# EAGLE schematic ME433_HW6_sch (EAGLE 9.6.2)
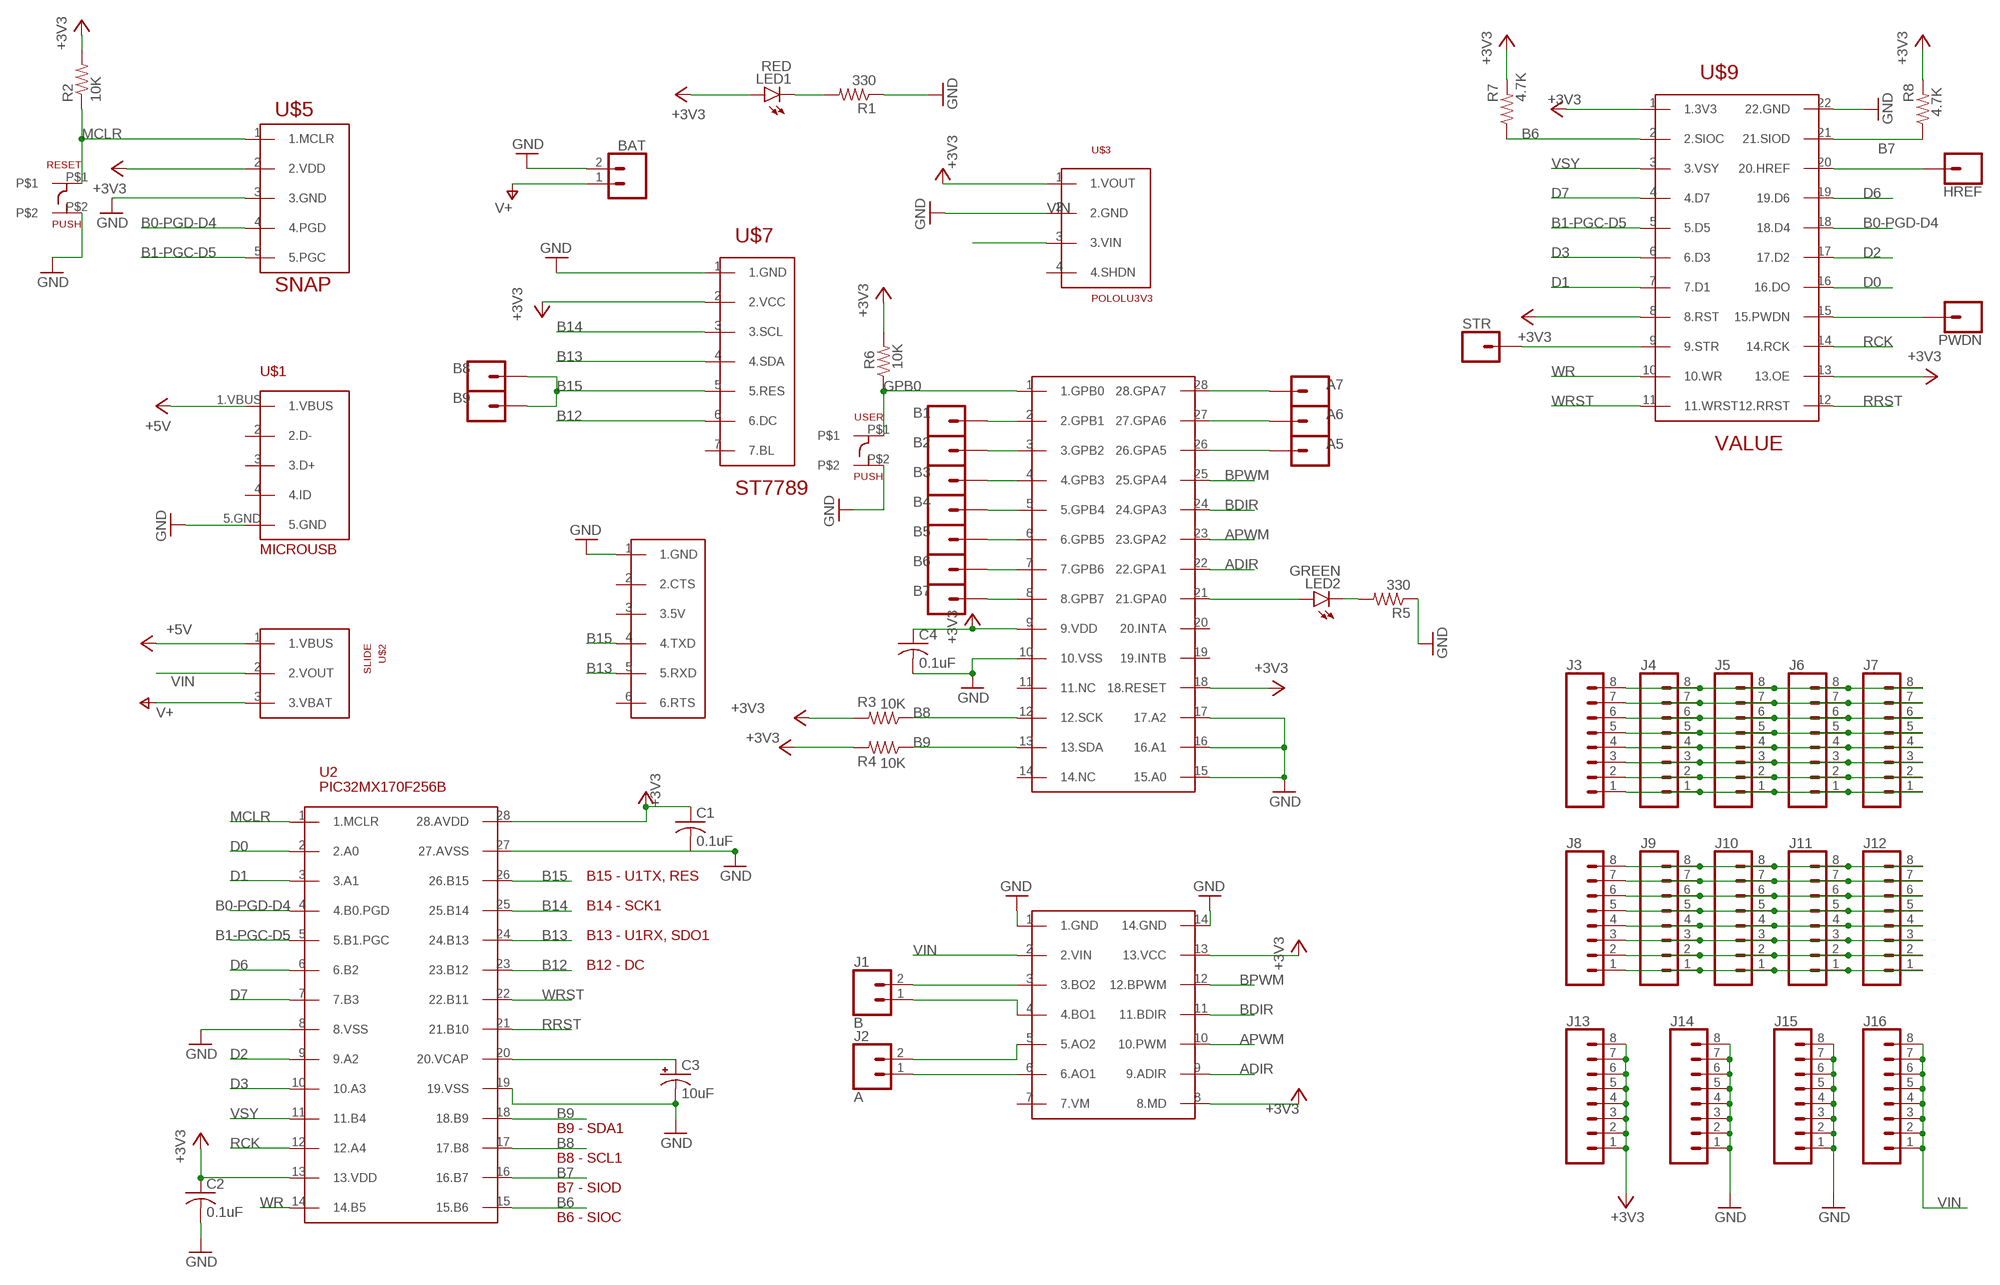
[diagram p0: schematic, sheet 1]

## Parts
A5  CONN_01  [1X01]
A6  CONN_01  [1X01]
A7  CONN_01  [1X01]
B1  CONN_01  [1X01]
B2  CONN_01  [1X01]
B3  CONN_01  [1X01]
B4  CONN_01  [1X01]
B5  CONN_01  [1X01]
B6  CONN_01  [1X01]
B7  CONN_01  [1X01]
B8  CONN_01  [1X01]
B9  CONN_01  [1X01]
BAT  CONN_02  [1X02]
C1  0.1uF  C-US025-030X050  [C025-030X050]
C2  0.1uF  C-US025-030X050  [C025-030X050]
C3  10uF  CPOL-USB45181B  [B45181B]
C4  0.1uF  C-US025-030X050  [C025-030X050]
HREF  CONN_01  [1X01]
J1  B  CONN_02  [1X02]
J2  A  CONN_02  [1X02]
J3  CONN_08"  [1X08]
J4  CONN_08"  [1X08]
J5  CONN_08"  [1X08]
J6  CONN_08"  [1X08]
J7  CONN_08"  [1X08]
J8  CONN_08"  [1X08]
J9  CONN_08"  [1X08]
J10  CONN_08"  [1X08]
J11  CONN_08"  [1X08]
J12  CONN_08"  [1X08]
J13  CONN_08"  [1X08]
J14  CONN_08"  [1X08]
J15  CONN_08"  [1X08]
J16  CONN_08"  [1X08]
LED1  RED  LED3MM  [LED3MM]
LED2  GREEN  LED3MM  [LED3MM]
PWDN  CONN_01  [1X01]
R1  330  R-US_0207/10  [0207/10]
R2  10K  R-US_0207/10  [0207/10]
R3  10K  R-US_0207/10  [0207/10]
R4  10K  R-US_0207/10  [0207/10]
R5  330  R-US_0207/10  [0207/10]
R6  10K  R-US_0207/10  [0207/10]
R7  4.7K  R-US_0207/10  [0207/10]
R8  4.7K  R-US_0207/10  [0207/10]
RESET  PUSH  [PUSH]
STR  CONN_01  [1X01]
U2  PIC32MX170F256B  [DIL28-3]
U$1  MICROUSB  [MICROUSB]
U$2  SLIDE  [SLIDE]
U$3  POLOLU3V3  [POLOLU3V3]
U$4  DRV8835  [DRV8835]
U$5  SNAP  [SNAP]
U$6  CP2104_FRIEND  [CP2104_FRIEND]
U$7  ST7789  [ST7789]
U$8  MCP23017  [DIL28-3]
U$9  OV7670FIFO  [OV7670FIFO]
USER  PUSH  [PUSH]

## Nets
+3V3: C1.1 C2.1 C4.1 J13.1 J13.2 J13.3 J13.4 J13.5 J13.6 J13.7 J13.8 LED1.A R2.2 R3.2 R4.2 R6.2 R7.2 R8.2 U2.13(13.VDD) U2.28(28.AVDD) U$3.1(1.VOUT) U$4.8(8.MD) U$4.13(13.VCC) U$5.2(2.VDD) U$7.2(2.VCC) U$8.9(9.VDD) U$8.18(18.RESET) U$9.1(1.3V3) U$9.8(8.RST) U$9.13(13.OE)
+5V: U$1.1.VBUS U$2.1(1.VBUS)
ADIR: U$4.9(9.ADIR) U$8.22(22.GPA1)
APWM: U$4.10(10.PWM) U$8.23(23.GPA2)
B0-PGD-D4: U2.4(4.B0.PGD) U$5.4(4.PGD) U$9.18(18.D4)
B1-PGC-D5: U2.5(5.B1.PGC) U$5.5(5.PGC) U$9.5(5.D5)
B6: R7.1 U2.15(15.B6) U$9.2(2.SIOC)
B7: R8.1 U2.16(16.B7) U$9.21(21.SIOD)
B8: R3.1 U2.17(17.B8) U$8.12(12.SCK)
B9: R4.1 U2.18(18.B9) U$8.13(13.SDA)
B12: U2.23(23.B12) U$7.6(6.DC)
B13: U2.24(24.B13) U$6.5(5.RXD) U$7.4(4.SDA)
B14: U2.25(25.B14) U$7.3(3.SCL)
B15: B8.1 B9.1 U2.26(26.B15) U$6.4(4.TXD) U$7.5(5.RES)
BDIR: U$4.11(11.BDIR) U$8.24(24.GPA3)
BPWM: U$4.12(12.BPWM) U$8.25(25.GPA4)
D0: U2.2(2.A0) U$9.16(16.DO)
D1: U2.3(3.A1) U$9.7(7.D1)
D2: U2.9(9.A2) U$9.17(17.D2)
D3: U2.10(10.A3) U$9.6(6.D3)
D6: U2.6(6.B2) U$9.19(19.D6)
D7: U2.7(7.B3) U$9.4(4.D7)
GND: BAT.2 C1.2 C2.2 C3.- C4.2 J14.1 J14.2 J14.3 J14.4 J14.5 J14.6 J14.7 J14.8 J15.1 J15.2 J15.3 J15.4 J15.5 J15.6 J15.7 J15.8 R1.1 R5.1 RESET.P$2 U2.8(8.VSS) U2.19(19.VSS) U2.27(27.AVSS) U$1.5.GND U$3.2(2.GND) U$4.1(1.GND) U$4.14(14.GND) U$5.3(3.GND) U$6.1(1.GND) U$7.1(1.GND) U$8.10(10.VSS) U$8.15(15.A0) U$8.16(16.A1) U$8.17(17.A2) U$9.22(22.GND) USER.P$2
GPB0: R6.1 U$8.1(1.GPB0) USER.P$1
MCLR: R2.1 RESET.P$1 U2.1(1.MCLR) U$5.1(1.MCLR)
N$1: LED1.K(C) R1.2
N$2: C3.+ U2.20(20.VCAP)
N$3: LED2.K(C) R5.2
N$4: LED2.A U$8.21(21.GPA0)
N$5: J1.2 U$4.3(3.BO2)
N$6: J1.1 U$4.4(4.BO1)
N$7: J2.2 U$4.5(5.AO2)
N$8: J2.1 U$4.6(6.AO1)
N$9: STR.1 U$9.9(9.STR)
N$10: HREF.1 U$9.20(20.HREF)
N$11: PWDN.1 U$9.15(15.PWDN)
N$12: B1.1 U$8.2(2.GPB1)
N$13: B2.1 U$8.3(3.GPB2)
N$14: B3.1 U$8.4(4.GPB3)
N$15: B4.1 U$8.5(5.GPB4)
N$16: B5.1 U$8.6(6.GPB5)
N$17: B6.1 U$8.7(7.GPB6)
N$18: B7.1 U$8.8(8.GPB7)
N$19: A7.1 U$8.28(28.GPA7)
N$20: A6.1 U$8.27(27.GPA6)
N$21: A5.1 U$8.26(26.GPA5)
N$22: J3.8 J4.8 J5.8 J6.8 J7.8
N$23: J3.7 J4.7 J5.7 J6.7 J7.7
N$24: J3.6 J4.6 J5.6 J6.6 J7.6
N$25: J3.5 J4.5 J5.5 J6.5 J7.5
N$26: J3.4 J4.4 J5.4 J6.4 J7.4
N$27: J3.3 J4.3 J5.3 J6.3 J7.3
N$28: J3.2 J4.2 J5.2 J6.2 J7.2
N$29: J3.1 J4.1 J5.1 J6.1 J7.1
N$30: J8.8 J9.8 J10.8 J11.8 J12.8
N$31: J8.7 J9.7 J10.7 J11.7 J12.7
N$32: J8.6 J9.6 J10.6 J11.6 J12.6
N$33: J8.5 J9.5 J10.5 J11.5 J12.5
N$34: J8.4 J9.4 J10.4 J11.4 J12.4
N$35: J8.3 J9.3 J10.3 J11.3 J12.3
N$36: J8.2 J9.2 J10.2 J11.2 J12.2
N$37: J8.1 J9.1 J10.1 J11.1 J12.1
RCK: U2.12(12.A4) U$9.14(14.RCK)
RRST: U2.21(21.B10) U$9.12(12.RRST)
V+: BAT.1 U$2.3(3.VBAT)
VIN: J16.1 J16.2 J16.3 J16.4 J16.5 J16.6 J16.7 J16.8 U$2.2(2.VOUT) U$3.3(3.VIN) U$4.2(2.VIN)
VSY: U2.11(11.B4) U$9.3(3.VSY)
WR: U2.14(14.B5) U$9.10(10.WR)
WRST: U2.22(22.B11) U$9.11(11.WRST)
Unconnected: U$1.2(2.D-) U$1.3(3.D+) U$1.4(4.ID) U$3.4(4.SHDN) U$4.7(7.VM) U$6.2(2.CTS) U$6.3(3.5V) U$6.6(6.RTS) U$7.7(7.BL) U$8.11(11.NC) U$8.14(14.NC) U$8.19(19.INTB) U$8.20(20.INTA)

## Notes on the sheet
- B15 - U1TX, RES
- B14 - SCK1
- B13 - U1RX, SDO1
- B12 - DC
- B9 - SDA1
- B8 - SCL1
- B7 - SIOD
- B6 - SIOC

## Library data of the parts
A5-A7 B1-B9 HREF PWDN STR = ME433:CONN_01: Single connection point. Often used as Generic Header-pin footprint for 0.1 inch spaced/style header connections On any of the 0.1 inch spaced packages, you can populate with these: Break Away Headers - Straight <https://www.sparkfun.com/products/116> (PRT-00116) Break Away Male Headers - Right Angle <https://www.sparkfun.com/products/553> (PRT-00553) Female Headers <https://www.sparkfun.com/products/115> (PRT-00115) Break Away Headers - Machine Pin <https://www.sparkfun.com/products/117> (PRT-00117) Break Away Female Headers - Swiss Machine Pin <https://www.sparkfun.com/products/743> (PRT-00743) This device is also useful as a general connection point to wire up your design to another part of your project. Our various solder wires solder well into these plated through hole pads. Hook-Up Wire - Assortment (Stranded, 22 AWG) <https://www.sparkfun.com/products/11375> (PRT-11375) Hook-Up Wire - Assortment (Solid Core, 22 AWG) <https://www.sparkfun.com/products/11367> (PRT-11367) View the entire wire category on our website here <https://www.sparkfun.com/categories/141> Special notes: SMTSO-256-ET is a "flush mount" nut for a 4-40 screw. We mostly use this on specialty testbeds; it is a nice way to connect hardware to your PCB at an adjustable hieght. Also note, the SNAP packages are for using a snappable style connector. We sell a baggie of snaps and they are also used on two LilyPad designs: Snap Assortment - 30 pack (male and female) <https://www.sparkfun.com/products/11347> (DEV-11347) LilyPad Arduino SimpleSnap <https://www.sparkfun.com/products/10941> (DEV-10941) LilyPad SimpleSnap Protoboard <https://www.sparkfun.com/products/10940> (DEV-10940)
BAT J1 J2 = ME433:CONN_02: Multi connection point. Often used as Generic Header-pin footprint for 0.1 inch spaced/style header connections On any of the 0.1 inch spaced packages, you can populate with these: Break Away Headers - Straight <https://www.sparkfun.com/products/116> (PRT-00116) Break Away Male Headers - Right Angle <https://www.sparkfun.com/products/553> (PRT-00553) Female Headers <https://www.sparkfun.com/products/115> (PRT-00115) Break Away Headers - Machine Pin <https://www.sparkfun.com/products/117> (PRT-00117) Break Away Female Headers - Swiss Machine Pin <https://www.sparkfun.com/products/743> (PRT-00743) For SCREWTERMINALS and SPRING TERMINALS visit here: Screw Terimnals on SparkFun.com <https://www.sparkfun.com/search/results?term=Screw+Terminals> (5mm/3.5mm/2.54mm spacing) This device is also useful as a general connection point to wire up your design to another part of your project. Our various solder wires solder well into these plated through hole pads. Hook-Up Wire - Assortment (Stranded, 22 AWG) <https://www.sparkfun.com/products/11375> (PRT-11375) Hook-Up Wire - Assortment (Solid Core, 22 AWG) <https://www.sparkfun.com/products/11367> (PRT-11367) View the entire wire category on our website here <https://www.sparkfun.com/categories/141> Special notes: Molex polarized connector foot print use with: PRT-08233 with associated crimp pins and housings. 2.54_SCREWTERM for use with PRT-10571. 3.5mm Screw Terminal footprints for PRT-08084 5mm Screw Terminal footprints for use with PRT-08432
C1 C2 C4 = ME433:C-US: CAPACITOR, American symbol; SPICEPREFIX: C
C3 = ME433:CPOL-US: POLARIZED CAPACITOR, American symbol; SPICEPREFIX: C
J3-J16 = ME433:CONN_08: Multi connection point. Often used as Generic Header-pin footprint for 0.1 inch spaced/style header connections On any of the 0.1 inch spaced packages, you can populate with these: Break Away Headers - Straight <https://www.sparkfun.com/products/116> (PRT-00116) Break Away Male Headers - Right Angle <https://www.sparkfun.com/products/553> (PRT-00553) Female Headers <https://www.sparkfun.com/products/115> (PRT-00115) Break Away Headers - Machine Pin <https://www.sparkfun.com/products/117> (PRT-00117) Break Away Female Headers - Swiss Machine Pin <https://www.sparkfun.com/products/743> (PRT-00743) Arduino Stackable Header - 8 Pin <https://www.sparkfun.com/products/9279> (PRT-09279) For SCREWTERMINALS and SPRING TERMINALS visit here: Screw Terimnals on SparkFun.com <https://www.sparkfun.com/search/results?term=Screw+Terminals> (5mm/3.5mm/2.54mm spacing) This device is also useful as a general connection point to wire up your design to another part of your project. Our various solder wires solder well into these plated through hole pads. Hook-Up Wire - Assortment (Stranded, 22 AWG) <https://www.sparkfun.com/products/11375> (PRT-11375) Hook-Up Wire - Assortment (Solid Core, 22 AWG) <https://www.sparkfun.com/products/11367> (PRT-11367) View the entire wire category on our website here <https://www.sparkfun.com/categories/141> Special notes: Molex polarized connector foot print use with SKU : PRT-08231 with associated crimp pins and housings. 1MM SMD Version SKU: PRT-10208 NOTES ON THE VARIANTS LOCK and LOCK_LONGPADS... This footprint was designed to help hold the alignment of a through-hole component (i.e. 6-pin header) while soldering it into place. You may notice that each hole has been shifted either up or down by 0.005 of an inch from it's more standard position (which is a perfectly straight line). This slight alteration caused the pins (the squares in the middle) to touch the edges of the holes. Because they are alternating, it causes a "brace" to hold the component in place. 0.005 has proven to be the perfect amount of "off-center" position when using our standard breakaway headers. Although looks a little odd when you look at the bare footprint, once you have a header in there, the alteration is very hard to notice. Also,if you push a header all the way into place, it is covered up entirely on the bottom side.; PROD_ID: CONN-08438
LED1 LED2 = ME433:LED: LED OSRAM: - CHIPLED LG R971, LG N971, LY N971, LG Q971, LY Q971, LO R971, LY R971 LH N974, LH R974 LS Q976, LO Q976, LY Q976 LO Q996 - Hyper CHIPLED LW Q18S LB Q993, LB Q99A, LB R99A - SideLED LS A670, LO A670, LY A670, LG A670, LP A670 LB A673, LV A673, LT A673, LW A673 LH A674 LY A675 LS A676, LA A676, LO A676, LY A676, LW A676 LS A679, LY A679, LG A679 - Hyper Micro SIDELED® LS Y876, LA Y876, LO Y876, LY Y876 LT Y87S - SmartLED LW L88C, LW L88S LB L89C, LB L89S, LG L890 LS L89K, LO L89K, LY L89K LS L896, LA L896, LO L896, LY L896 - TOPLED LS T670, LO T670, LY T670, LG T670, LP T670 LSG T670, LSP T670, LSY T670, LOP T670, LYG T670 LG T671, LOG T671, LSG T671 LB T673, LV T673, LT T673, LW T673 LH T674 LS T676, LA T676, LO T676, LY T676, LB T676, LH T676, LSB T676, LW T676 LB T67C, LV T67C, LT T67C, LS T67K, LO T67K, LY T67K, LW E67C LS E67B, LA E67B, LO E67B, LY E67B, LB E67C, LV E67C, LT E67C LW T67C LS T679, LY T679, LG T679 LS T770, LO T770, LY T770, LG T770, LP T770 LB T773, LV T773, LT T773, LW T773 LH T774 LS E675, LA E675, LY E675, LS T675 LS T776, LA T776, LO T776, LY T776, LB T776 LHGB T686 LT T68C, LB T68C - Hyper Mini TOPLED® LB M676 - Mini TOPLED Santana® LG M470 LS M47K, LO M47K, LY M47K Source: http://www.osram.convergy.de LUXEON: - LUMILED® LXK2-PW12-R00, LXK2-PW12-S00, LXK2-PW14-U00, LXK2-PW14-V00 LXK2-PM12-R00, LXK2-PM12-S00, LXK2-PM14-U00 LXK2-PE12-Q00, LXK2-PE12-R00, LXK2-PE12-S00, LXK2-PE14-T00, LXK2-PE14-U00 LXK2-PB12-K00, LXK2-PB12-L00, LXK2-PB12-M00, LXK2-PB14-N00, LXK2-PB14-P00, LXK2-PB14-Q00 LXK2-PR12-L00, LXK2-PR12-M00, LXK2-PR14-Q00, LXK2-PR14-R00 LXK2-PD12-Q00, LXK2-PD12-R00, LXK2-PD12-S00 LXK2-PH12-R00, LXK2-PH12-S00 LXK2-PL12-P00, LXK2-PL12-Q00, LXK2-PL12-R00 Source: www.luxeon.com KINGBRIGHT: KA-3528ASYC Source: www.kingbright.com
R1-R8 = ME433:R-US_: RESISTOR, American symbol; SPICEPREFIX: R
RESET USER = ME433:PUSH
U2 = ME433:PIC32MX170F256B
U$1 = ME433:MICROUSB
U$2 = ME433:SLIDE
U$3 = ME433:POLOLU3V3
U$4 = ME433:DRV8835
U$5 = ME433:SNAP
U$6 = ME433:CP2104_FRIEND
U$7 = ME433:ST7789
U$8 = ME433:MCP23017
U$9 = ME433:OV7670FIFO